# Altium schematic sheet 3V3_buck.SchDoc
size A
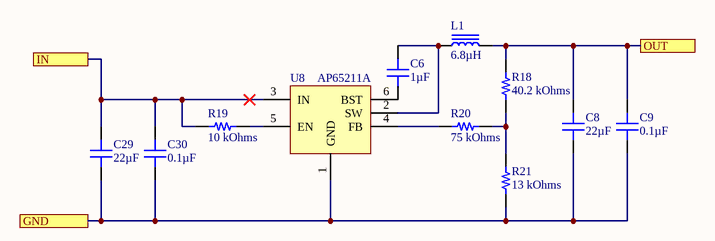
[diagram p0: 3V3_buck.SchDoc]

## Parts
C6  1µF  [CAP 0402_1005]
C8  22µF  [CAP 0402_1005]
C9  0.1µF  [CAP 0402_1005]
C29  22µF  [CAP 0402_1005]
C30  0.1µF  [CAP 0402_1005]
L1  6.8µH  [IND 0806_2016]
R18  40.2 kOhms  [RES 0402_1005]
R19  10 kOhms  [RES 0402_1005]
R20  75 kOhms  [RES 0402_1005]
R21  13 kOhms  [RES 0402_1005]
U8  AP65211A  [TSOT-26-6]

## Ports
GND, IN, OUT

## Nets
GND: C8.1 C9.1 C29.1 C30.1 R21.1 U8.1(GND) ; port GND
IN: C29.2 C30.2 R19.1 U8.3(IN) ; port IN
OUT: C8.2 C9.2 L1.2 R18.2 ; port OUT
NetC6_1: C6.1 U8.6(BST)
NetC6_2: C6.2 L1.1 U8.2(SW)
NetR18_1: R18.1 R20.2 R21.2
NetR19_2: R19.2 U8.5(EN)
NetR20_1: R20.1 U8.4(FB)

## Library data of the parts
C6 C8 C29 = CGA2B3X5R1V104K050BB: CAP CER 0.1UF 35V X5R 0402; Manufacturer: TDK Corporation; Capacitance: 0.1µF; Tolerance: ±10%; Part Number: CGA2B3X5R1V104K050BB; Applications: Automotive; ComponentLink1Description: Datasheet; ComponentLink1URL: https://product.tdk.com/info/en/catalog/datasheets/mlcc_automotive_general_en.pdf?ref_disty=digikey; ComponentLink2Description: DigiKey Link; ComponentLink2URL: http://digikey.com/product-detail/en/tdk-corporation/CGA2B3X5R1V104K050BB/445-12199-1-ND/3953865; Device Package: 0402 (1005 Metric); LastUpdated: 02-Sep-20 1:01:59 AM; Lifecycle Status: Active; Minimum Order: 1; Mounting Type: Surface Mount, MLCC; Operating Temperature: -55°C ~ 85°C; Package / Case: 0402 (1005 Metric); Packaging: TapeAndReel; PartId: 11879; Part Status: Active; Price: 0.02; Ratings: AEC-Q200; Series: CGA; Size / Dimension: 0.039" L x 0.020" W (1.00mm x 0.50mm); Supplier 1: DigiKey; Supplier Part Number 1: 445-12199-1-ND; Temperature Coefficient: X5R; Thickness (Max): 0.022" (0.55mm); Voltage - Rated: 35V
  C6: Value: 1µF
  C8 C29: Value: 22µF
C9 C30 = CGA2B3X5R1V104K050BB: CAP CER 0.1UF 35V X5R 0402; Manufacturer: TDK Corporation; Tolerance: ±10%; Part Number: CGA2B3X5R1V104K050BB; Value: 0.1µF; Applications: Automotive; Capacitance: 0.1µF; ComponentLink1Description: Datasheet; ComponentLink1URL: https://product.tdk.com/info/en/catalog/datasheets/mlcc_automotive_general_en.pdf?ref_disty=digikey; ComponentLink2Description: DigiKey Link; ComponentLink2URL: http://digikey.com/product-detail/en/tdk-corporation/CGA2B3X5R1V104K050BB/445-12199-1-ND/3953865; Device Package: 0402 (1005 Metric); LastUpdated: 02-Sep-20 1:01:59 AM; Lifecycle Status: Active; Minimum Order: 1; Mounting Type: Surface Mount, MLCC; Operating Temperature: -55°C ~ 85°C; Package / Case: 0402 (1005 Metric); Packaging: TapeAndReel; PartId: 11879; Part Status: Active; Price: 0.02; Ratings: AEC-Q200; Series: CGA; Size / Dimension: 0.039" L x 0.020" W (1.00mm x 0.50mm); Supplier 1: DigiKey; Supplier Part Number 1: 445-12199-1-ND; Temperature Coefficient: X5R; Thickness (Max): 0.022" (0.55mm); Voltage - Rated: 35V
L1 = VLS201612HBX-6R8M-1: FIXED IND 6.8UH 910MA 468 MOHM; Manufacturer: TDK Corporation; Current - Saturation: 870mA; DC Resistance (DCR): 468mOhm Max; Inductance Frequency - Test: 1MHz; Material - Core: Metal; Shielding: Shielded; Tolerance: ±20%; Type: Wirewound; Part Number: VLS201612HBX-6R8M-1; ComponentLink1Description: Datasheet; ComponentLink1URL: https://product.tdk.com/info/en/catalog/datasheets/inductor_commercial_power_vls201612hbx-1_en.pdf?ref_disty=digikey; ComponentLink2Description: DigiKey Link; ComponentLink2URL: http://digikey.com/product-detail/en/tdk-corporation/VLS201612HBX-6R8M-1/445-173015-1-ND/5250934; Current Rating (Amps): 910mA; Device Package: 0806 (2016 Metric); Height - Seated (Max): 0.047" (1.20mm); Inductance: 6.8µH; LastUpdated: 02-Sep-20 1:24:37 AM; Lifecycle Status: Active; Minimum Order: 1; Mounting Type: Surface Mount; Operating Temperature: -40°C ~ 105°C; Package / Case: 0806 (2016 Metric); Packaging: TapeAndReel; PartId: 223; Part Status: Active; Price: 0.13; Series: VLS-HBX-1; Size / Dimension: 0.079" L x 0.063" W (2.00mm x 1.60mm); Supplier 1: DigiKey; Supplier Part Number 1: 445-173015-1-ND; Supplier Device Package: 0806 (2016 Metric); Value: 6.8µH
R18-R21 = ERJ-2GEJ102X: RES SMD 1K OHM 5% 1/10W 0402; Manufacturer: Panasonic Electronic Components; Power (Watts): 0.1W, 1/10W; Resistance: 1 kOhms; Temperature Coefficient: ±200ppm/°C; Part Number: ERJ-2GEJ102X; ComponentLink1Description: Datasheet; ComponentLink1URL: https://b2b-api.panasonic.eu/file_stream/pids/fileversion/1242; ComponentLink2Description: DigiKey Link; ComponentLink2URL: http://digikey.com/product-detail/en/panasonic-electronic-components/ERJ-2GEJ102X/P1.0KJCT-ND/146897; Composition: Thick Film; Device Package: 0402 (1005 Metric); Features: Automotive AEC-Q200; Height - Seated (Max): 0.016" (0.40mm); LastUpdated: 02-Sep-20 1:07:36 AM; Lifecycle Status: Active; Minimum Order: 1; Number of Terminations: 2; Operating Temperature: -55°C ~ 155°C; Package / Case: 0402 (1005 Metric); Packaging: CutTape; PartId: 17614; Part Status: Active; Price: 0.10; Ratings: AEC-Q200; Series: ERJ; Size / Dimension: 0.039" L x 0.020" W (1.00mm x 0.50mm); Supplier 1: DigiKey; Supplier Part Number 1: P1.0KJCT-ND; Supplier Device Package: 0402; Tolerance: ±5%
  R18: Value: 40.2 kOhms
  R19: Value: 10 kOhms
  R20: Value: 75 kOhms
  R21: Value: 13 kOhms
U8 = AP65211A: ADJ step down Buck